# EAGLE design motor_breakout (EAGLE 7.7.0)
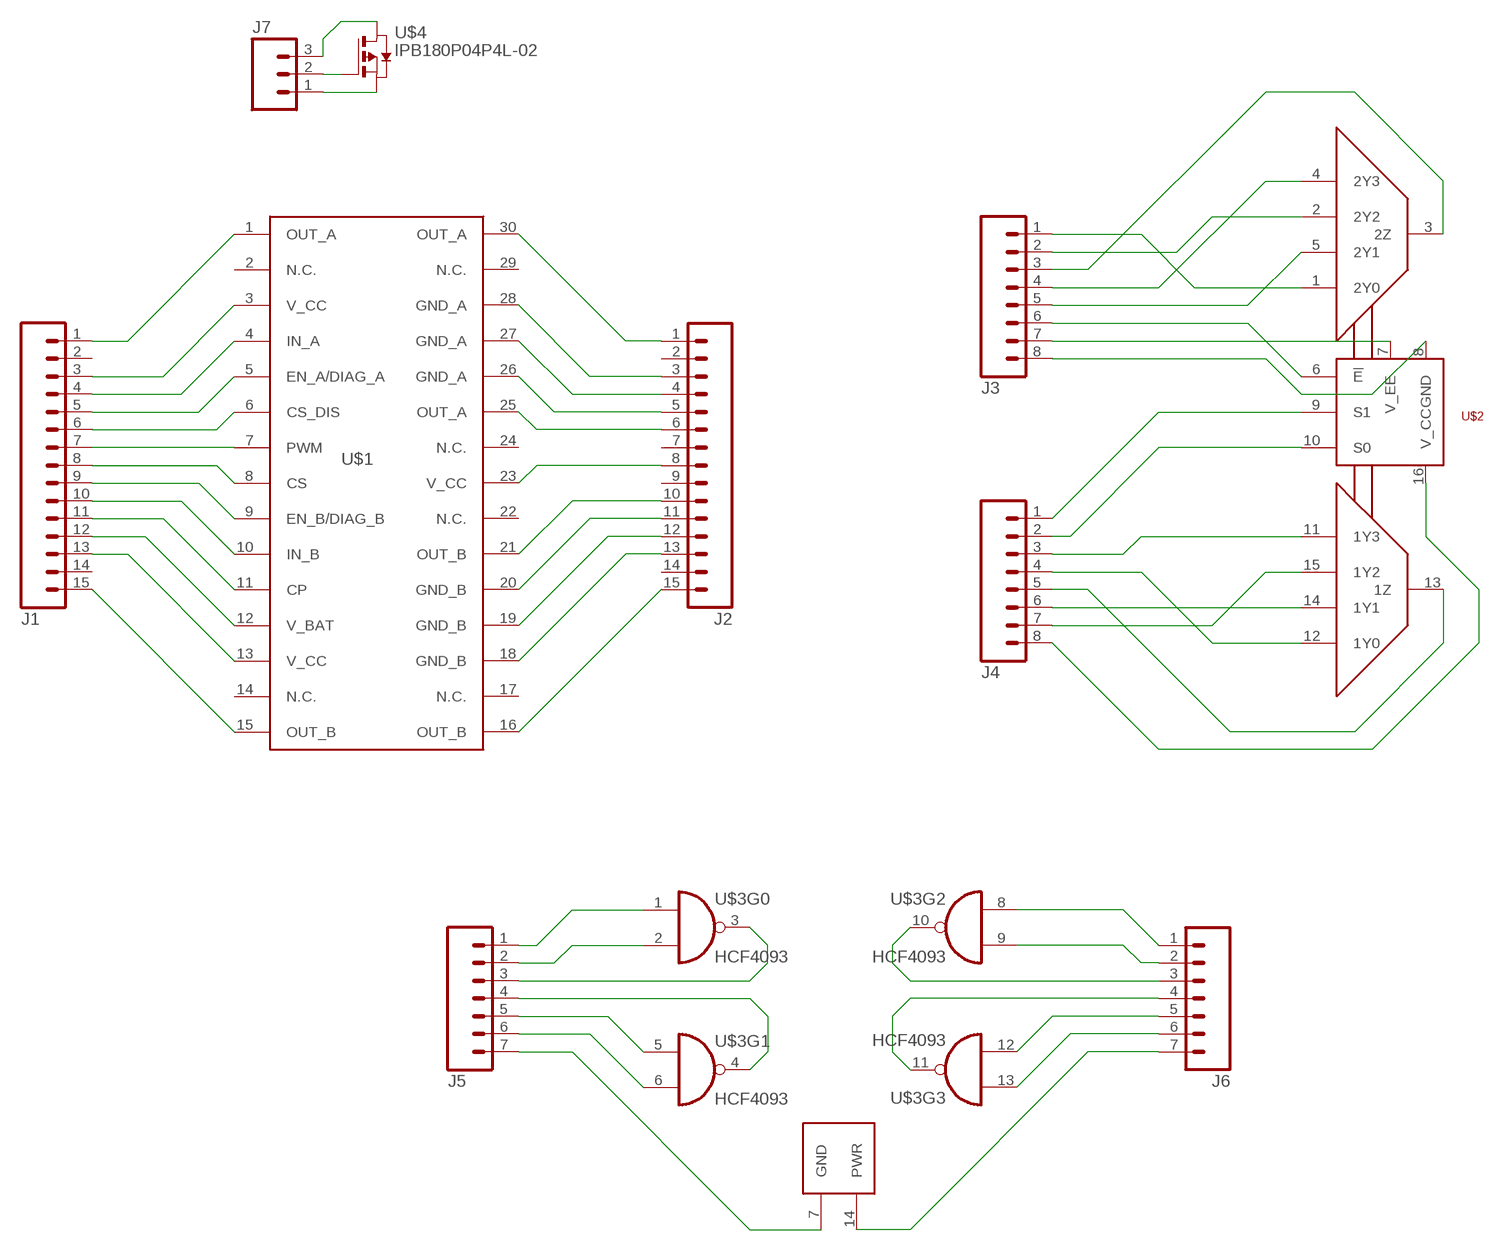
[diagram p0: schematic, sheet 1]

## Parts
J1  M15  [1X15]
J2  M15  [1X15]
J3  M08SILK_FEMALE_PTH  [1X08]
J4  M08SILK_FEMALE_PTH  [1X08]
J5  M07  [1X07]
J6  M07  [1X07]
J7  M03PTH  [1X03]
U$1  VNH5019A-E  [MULTIPOWERSO-30]
U$2  74HC4052-Q100  [SO16]
U$3  HCF4093  [SO14]
U$4  IPB180P04P4L-02  [PG-TO263-7-3]

## Nets
GND_A: J2.3 J2.4 J2.5 U$1.26(GND_A) U$1.27(GND_A) U$1.28(GND_A)
GND_B: J2.11 J2.12 J2.13 U$1.18(GND_B) U$1.19(GND_B) U$1.20(GND_B)
N$1: J1.7 U$1.7(PWM)
N$2: J7.2 U$4.1(G)
N$3: J1.8 U$1.8(CS)
N$4: J1.6 U$1.6(CS_DIS)
N$5: J1.9 U$1.9(EN_B/DIAG_B)
N$6: J1.5 U$1.5(EN_A/DIAG_A)
N$7: J1.4 U$1.4(IN_A)
N$9: J1.10 U$1.10(IN_B)
N$10: J1.11 U$1.11(CP)
N$11: J1.12 U$1.12(V_BAT)
N$32: J3.1 U$2.1(2Y0)
N$33: J3.2 U$2.2(2Y2)
N$34: J3.3 U$2.3(2Z)
N$35: J3.4 U$2.4(2Y3)
N$36: J3.5 U$2.5(2Y1)
N$37: J3.6 U$2.6(!E)
N$38: J3.7 U$2.7(V_EE)
N$39: J3.8 U$2.8(GND)
N$40: J4.1 U$2.9(S1)
N$41: J4.2 U$2.10(S0)
N$42: J4.3 U$2.11(1Y3)
N$43: J4.4 U$2.12(1Y0)
N$44: J4.5 U$2.13(1Z)
N$45: J4.6 U$2.14(1Y1)
N$46: J4.7 U$2.15(1Y2)
N$47: J4.8 U$2.16(V_CC)
N$48: J5.1 U$3.1(I0)
N$49: J5.2 U$3.2(I1)
N$50: J5.3 U$3.3(O)
N$51: J5.4 U$3.4(O)
N$52: J5.5 U$3.5(I0)
N$53: J5.6 U$3.6(I1)
N$54: J5.7 U$3.7(GND)
N$55: J6.1 U$3.8(I0)
N$56: J6.2 U$3.9(I1)
N$57: J6.3 U$3.10(O)
N$58: J6.4 U$3.11(O)
N$59: J6.5 U$3.12(I1)
N$60: J6.6 U$3.13(I0)
N$61: J6.7 U$3.14(PWR)
N$62: J7.1 U$4.2(S) U$4.3(S) U$4.5(S) U$4.6(S) U$4.7(S)
N$63: J7.3 U$4.8(D)
OUT_A: J1.1 J2.1 J2.6 U$1.1(OUT_A) U$1.25(OUT_A) U$1.30(OUT_A)
OUT_B: J1.15 J2.10 J2.15 U$1.15(OUT_B) U$1.16(OUT_B) U$1.21(OUT_B)
VCC: J1.3 J1.13 J2.8 U$1.3(V_CC) U$1.13(V_CC) U$1.23(V_CC)
Unconnected: J1.2 J1.14 J2.2 J2.7 J2.9 J2.14 U$1.2(N.C.) U$1.14(N.C.) U$1.17(N.C.) U$1.22(N.C.) U$1.24(N.C.) U$1.29(N.C.)

## Library data of the parts
J1 J2 = SparkFun-Connectors:M15: Header 15 Standard 15-pin 0.1" header. Use with straight break away headers (SKU : PRT-00116), right angle break away headers (PRT-00553), swiss pins (PRT-00743), machine pins (PRT-00117), and female headers (PRT-00115).
J3 J4 = SparkFun-Connectors:M08: Header 8 Standard 8-pin 0.1" header. Use with straight break away headers (SKU : PRT-00116), right angle break away headers (PRT-00553), swiss pins (PRT-00743), machine pins (PRT-00117), and female headers (PRT-00115).; PROD_ID: CONN-08438
J5 J6 = SparkFun-Connectors:M07: Header 7 Standard 7-pin 0.1" header. Use with straight break away headers (SKU : PRT-00116), right angle break away headers (PRT-00553), swiss pins (PRT-00743), machine pins (PRT-00117), and female headers (PRT-00115). NOTES ON THE VARIANTS LOCK and LOCK_LONGPADS... This footprint was designed to help hold the alignment of a through-hole component (i.e. 7-pin header) while soldering it into place. You may notice that each hole has been shifted either up or down by 0.005 of an inch from it's more standard position (which is usually a perfectly straight line). This slight alteration caused the pins (the squares in the middle) to touch the edges of the holes. Because they are alternating, it causes a "brace" to hold the header in place. 0.005 has proven to be the perfect amount of "off-center" position when using our standard breakaway headers. Although looks a little odd when you look at the bare footprint, once you have a header in there, the alteration is very hard to notice. Also, if you push a header all the way into place, it is covered up entirely on the bottom side. This idea of altering the position of holes to aid alignment will be further integrated into the Sparkfun Library for other footprints. It can help hold any component with 3 or more connection pins.
J7 = SparkFun-Connectors:M03: Header 3 Standard 3-pin 0.1" header. Use with straight break away headers (SKU : PRT-00116), right angle break away headers (PRT-00553), swiss pins (PRT-00743), machine pins (PRT-00117), and female headers (PRT-00115). Molex polarized connector foot print use with SKU : PRT-08232 with associated crimp pins and housings.
U$1 = ARVP:VNH5019A-E
U$2 = ARVP:74HC4052-Q100
U$3 = ARVP:HCF4093: Quad 2 Input NAND IC
U$4 = ARVP:IPB180P04P4L-02

## Board
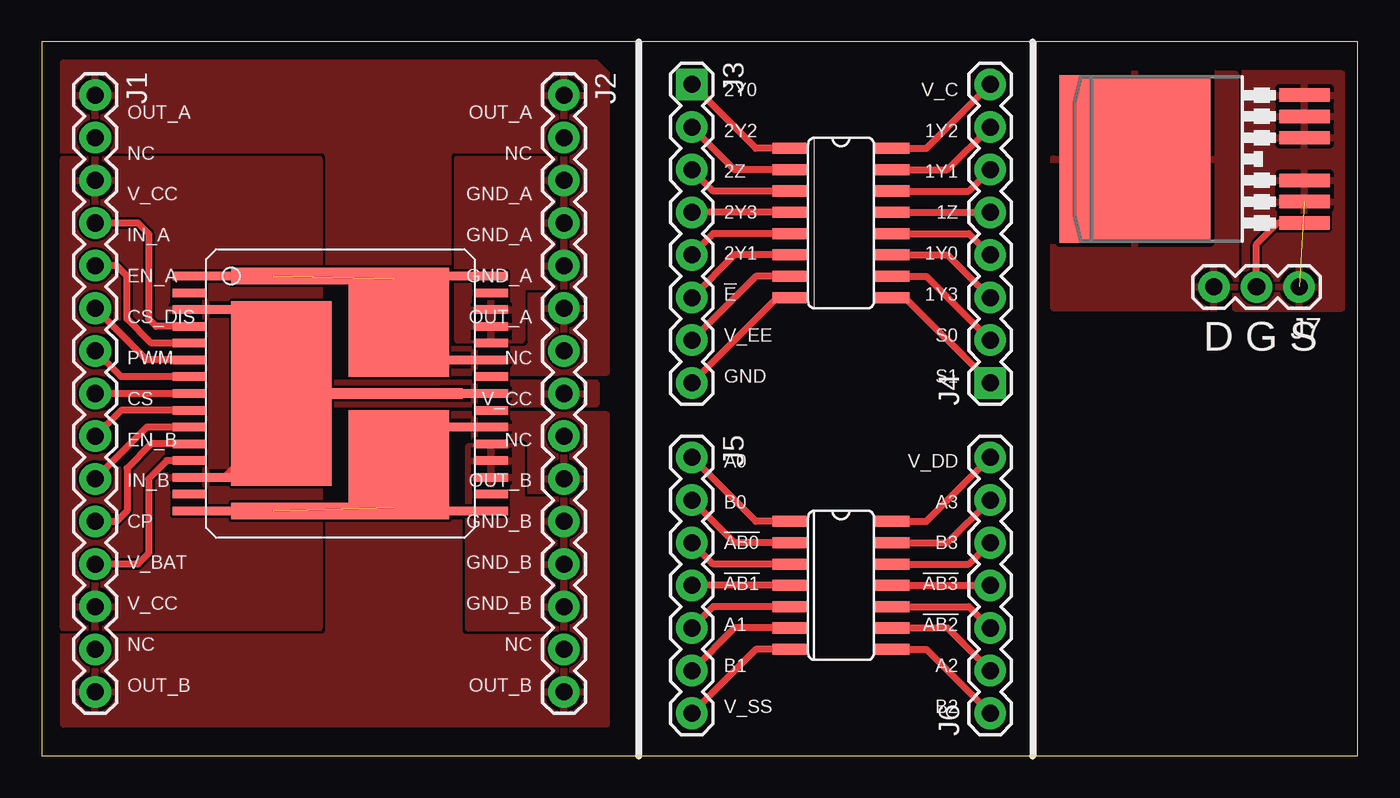
[diagram p1: board, top side]

Size 78.41 x 42.53 mm. Coordinates in mm from the lower left corner, seen from the top.
Outline: 0,0 78.41,0 78.41,42.53 0,42.53 0,0
Copper layers (1*16): Top 0.035mm / dielectric 1.5mm / Bottom 0.035mm
Design rules "ITEADstudioDRC": minimum track width 6mil, minimum drill 12mil, track to track 6mil, track to pad 6mil, pad to pad 6mil, via to via 6mil, smd to smd 0mil, copper to edge 10mil, drill to drill 10mil, minimum pad ring 10mil, minimum via ring 6mil, stop-mask expansion 2mil, vias tented up to drill 100mil, thermal gap 10mil

### Footprints (pad centres in the part's own frame; a part is rotated, then mirrored left to right if it is on the bottom)
1X15 = drill 1.016 pad 1.88: 1 0,0; 2 2.54,0; 3 5.08,0; 4 7.62,0; 5 10.16,0; 6 12.7,0; 7 15.24,0; 8 17.78,0; 9 20.32,0; 10 22.86,0; 11 25.4,0; 12 27.94,0; 13 30.48,0; 14 33.02,0; 15 35.56,0
1X08 = drill 1.016 pad 1.88 square: 1 0,0 | drill 1.016 pad 1.88: 2 2.54,0; 3 5.08,0; 4 7.62,0; 5 10.16,0; 6 12.7,0; 7 15.24,0; 8 17.78,0
1X07 = drill 1.016 pad 1.88: 1 0,0; 2 2.54,0; 3 5.08,0; 4 7.62,0; 5 10.16,0; 6 12.7,0; 7 15.24,0
1X03 = drill 1.016 pad 1.88: 1 0,0; 2 2.54,0; 3 5.08,0
MULTIPOWERSO-30 = smd 0.508 x 12: 1 -7,-4; 15 7,-4; 16 7,4; 30 -7,4 | smd 0.508 x 2: 2 -6,-9; 4 -4,-9; 5 -3,-9; 6 -2,-9; 7 -1,-9; 8 0,-9; 9 1,-9; 10 2,-9; 11 3,-9; 12 4,-9; 14 6,-9; 17 6,9; 18 5,9; 19 4,9; 20 3,9; 22 1,9; 24 -1,9; 26 -3,9; 27 -4,9; 28 -5,9; 29 -6,9 | smd 0.508 x 4: 3 -5,-8; 13 5,-8; 21 2,8; 23 0,8; 25 -2,8 | smd 6.5 x 6: OUTA -4.25,3.5; OUTB 4.25,3.5 | smd 1 x 7.5: OUTA@1 -7,-2.755; OUTB@1 7,-2.755 | smd 11 x 6: VCC 0,-3.5 | smd 0.65 x 8.3: VCC@1 0,3.145
SO16 = smd 0.66 x 2.032: 1 -4.445,-3.073; 2 -3.175,-3.073; 3 -1.905,-3.073; 4 -0.635,-3.073; 5 0.635,-3.073; 6 1.905,-3.073; 7 3.175,-3.073; 8 4.445,-3.073; 9 4.445,3.073; 10 3.175,3.073; 11 1.905,3.073; 12 0.635,3.073; 13 -0.635,3.073; 14 -1.905,3.073; 15 -3.175,3.073; 16 -4.445,3.073
SO14 = smd 0.66 x 2.032: 1 -3.81,-3.073; 2 -2.54,-3.073; 3 -1.27,-3.073; 4 0,-3.073; 5 1.27,-3.073; 6 2.54,-3.073; 7 3.81,-3.073; 8 3.81,3.073; 9 2.54,3.073; 10 1.27,3.073; 11 0,3.073; 12 -1.27,3.073; 13 -2.54,3.073; 14 -3.81,3.073
PG-TO263-7-3 = smd 0.8 x 3: 1 -3.81,-9.207; 2 -2.54,-9.207; 3 -1.27,-9.207; 5 1.27,-9.207; 6 2.54,-9.207; 7 3.81,-9.207 | smd 10 x 9: 8 0,0.895

### Placement (x,y rotation side)
J1  3.17,39.37 270 top
J2  31.11,39.37 270 top
J3  38.73,40.01 270 top
J4  56.52,22.23 90 top
J5  38.73,17.78 270 top
J6  56.52,2.54 90 top
J7  74.93,27.94 180 top
U$1  17.78,21.59 270 top
U$2  47.62,31.75 270 top
U$3  47.62,10.16 270 top
U$4  66.04,35.56 90 top

### Tracks (layer width: path | path; a pad name or v marks a point on that pad's centre or on a via)
GND_A
  pour Top: 31.75,35.56 31.75,27.94 28.57,27.94 28.57,24.77 24.77,24.77 24.77,35.56
GND_B
  pour Top: 31.75,7.62 31.75,15.24 28.57,15.24 28.57,18.41 25.4,18.41 25.4,7.62
N$1
  Top 0.406: U$1.7 4.71,22.59 J1.7
N$2
  Top 0.406: J7.2 72.39,30.48 73.66,31.75 U$4.1
N$3
  Top 0.406: U$1.8 J1.8
N$4
  Top 0.406: U$1.6 6.25,23.59 J1.6
N$5
  Top 0.406: U$1.9 4.71,20.59 J1.9
N$6
  Top 0.406: U$1.5 6.53,24.59 5.08,26.04 5.08,28.57 4.45,29.21 J1.5
N$7
  Top 0.406: J1.4 5.71,31.75 6.35,31.11 6.35,26.04 6.79,25.59 U$1.4
N$9
  Top 0.406: U$1.10 6.25,19.59 J1.10
N$10
  Top 0.406: J1.11 4.45,13.97 5.08,14.61 5.08,17.14 6.53,18.59 U$1.11
N$11
  Top 0.406: U$1.12 7.43,17.59 6.35,16.51 6.35,12.06 5.71,11.43 J1.12
N$32
  Top 0.406: U$2.1 42.55,36.2 J3.1
N$33
  Top 0.406: U$2.2 41.27,34.92 J3.2
N$34
  Top 0.406: U$2.3 40.01,33.66 J3.3
N$35
  Top 0.406: U$2.4 J3.4
N$36
  Top 0.406: U$2.5 40.01,31.11 J3.5
N$37
  Top 0.406: U$2.6 41.27,29.84 J3.6
N$38
  Top 0.406: U$2.7 42.55,28.57 J3.7
N$39
  Top 0.406: J3.8 43.81,27.3 U$2.8
N$40
  Top 0.406: U$2.9 51.44,27.3 J4.1
N$41
  Top 0.406: U$2.10 52.7,28.57 J4.2
N$42
  Top 0.406: U$2.11 53.98,29.84 J4.3
N$43
  Top 0.406: U$2.12 55.24,31.11 J4.4
N$44
  Top 0.406: U$2.13 J4.5
N$45
  Top 0.406: U$2.14 55.24,33.66 J4.6
N$46
  Top 0.406: U$2.15 53.98,34.92 J4.7
N$47
  Top 0.406: U$2.16 52.7,36.2 J4.8
N$48
  Top 0.406: U$3.1 42.55,13.97 J5.1
N$49
  Top 0.406: U$3.2 41.27,12.7 J5.2
N$50
  Top 0.406: U$3.3 40.01,11.43 J5.3
N$51
  Top 0.406: U$3.4 J5.4
N$52
  Top 0.406: U$3.5 40.01,8.89 J5.5
N$53
  Top 0.406: U$3.6 41.27,7.62 J5.6
N$54
  Top 0.406: U$3.7 42.55,6.35 J5.7
N$55
  Top 0.406: U$3.8 52.7,6.35 J6.1
N$56
  Top 0.406: U$3.9 53.98,7.62 J6.2
N$57
  Top 0.406: U$3.10 55.24,8.89 J6.3
N$58
  Top 0.406: U$3.11 J6.4
N$59
  Top 0.406: U$3.12 55.24,11.43 J6.5
N$60
  Top 0.406: U$3.13 53.98,12.7 J6.6
N$61
  Top 0.406: U$3.14 52.7,13.97 J6.7
N$62  (1 unrouted)
  pour Top (rank 2): 71.12,26.67 77.47,26.67 77.47,40.64 71.12,40.64
N$63
  pour Top: 71.12,26.67 60.33,26.67 60.33,40.64 71.12,40.64
OUT_A  (1 unrouted)
  Top 0.406: U$1.25 22.77,23.59 20.95,25.4 20.95,28.4 U$1.30
  pour Top (rank 2): 17.78,22.86 33.66,22.86 33.66,40.64 33.02,41.27 1.27,41.27 1.27,27.94 17.78,27.94
OUT_B  (1 unrouted)
  Top 0.406: U$1.21 23.4,19.59 20.95,17.14 20.95,14.78 U$1.16
  pour Top (rank 2): 1.27,15.24 1.27,1.91 33.66,1.91 33.66,20.32 17.78,20.32 17.78,15.24
VCC
  Top 0.406: U$1.13 10.88,16.59 15.88,21.59 U$1.23
  pour Top: 1.27,35.56 16.51,35.56 16.51,22.23 33.02,22.23 33.02,20.95 16.51,20.95 16.51,7.62 1.27,7.62

### Text on the board
tNames: D G S | 2Y0 / / 2Y2 / / 2Z / / 2Y3 / / 2Y1 / / !E / / V_EE / / GND | V_C / / 1Y2 / / 1Y1 / / 1Z / / 1Y0 / / 1Y3 / / S0 / / S1 | OUT_A / / NC / / V_CC / / IN_A / / EN_A / / CS_DIS / / PWM / / CS / / EN_B / / IN_B / / CP / / V_BAT / / V_CC / / NC / / OUT_B | OUT_A / / NC / / GND_A / / GND_A / / GND_A / / OUT_A / / NC / / V_CC / / NC / / OUT_B / / GND_B / / GND_B / / GND_B / / NC / / OUT_B | A0 / / B0 / / !AB0 / / !AB1 / / A1 / / B1 / / V_SS | V_DD / / A3 / / B3 / / !AB3 / / !AB2 / / A2 / / B2